# Altium schematic sheet Power Interface.SchDoc
size A; SheetNumber: 1; SheetTotal: 5
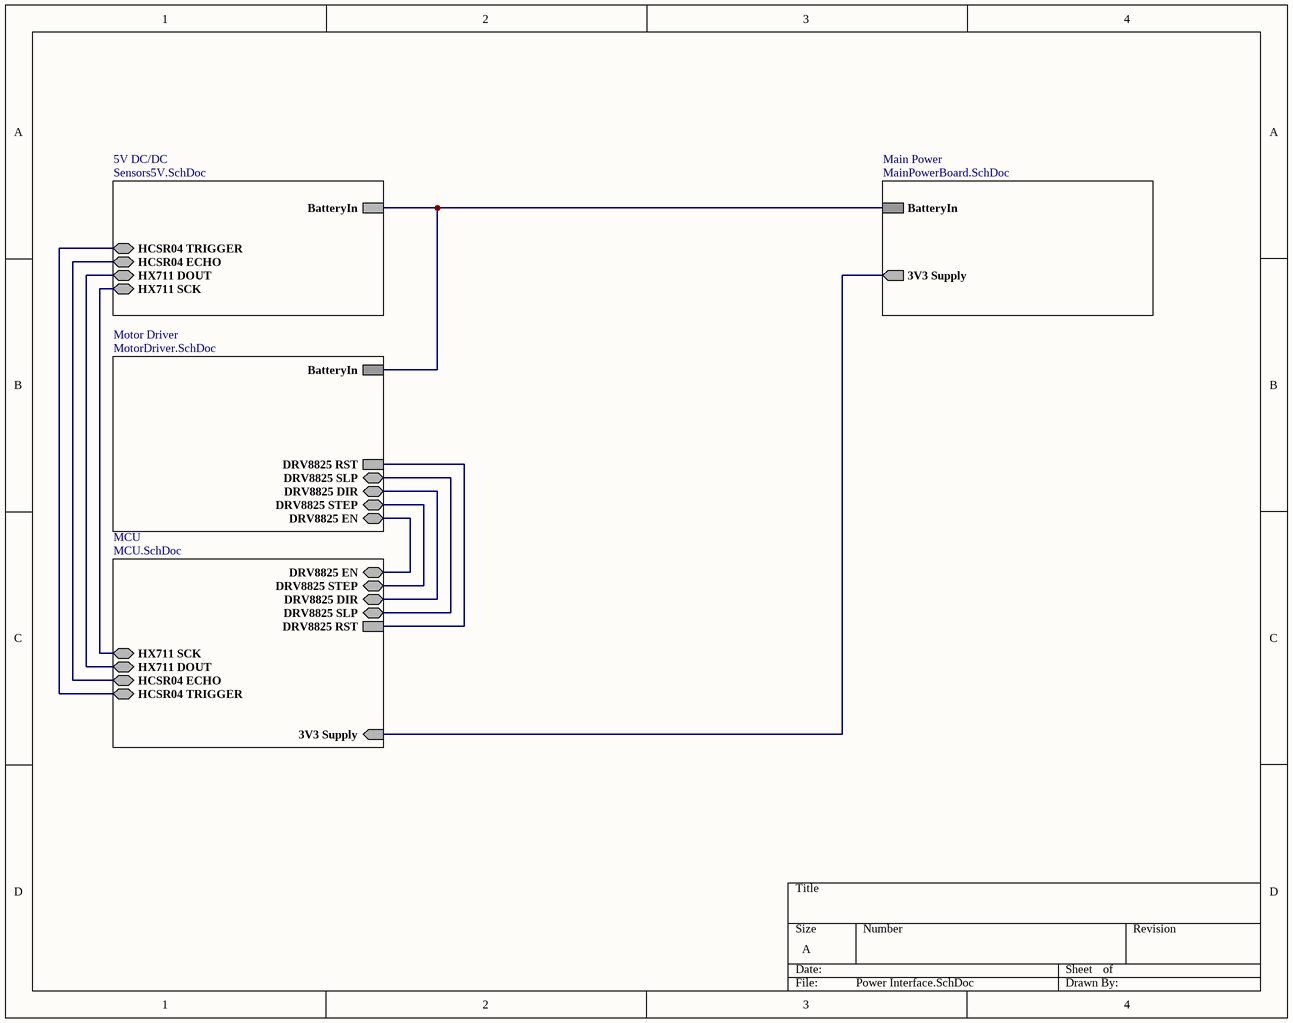
[diagram p0: Power Interface.SchDoc]

## Sub-sheets
5V DC/DC = Sensors5V.SchDoc: BatteryIn, HX711 DOUT (bidir), HX711 SCK (bidir), HCSR04 ECHO (bidir), HCSR04 TRIGGER (bidir)
Main Power = MainPowerBoard.SchDoc: BatteryIn, 3V3 Supply (out)
MCU = MCU.SchDoc: 3V3 Supply (in), DRV8825 EN (bidir), DRV8825 STEP (bidir), DRV8825 SLP (bidir), DRV8825 DIR (bidir), DRV8825 RST, HX711 SCK (bidir), HX711 DOUT (bidir), HCSR04 ECHO (bidir), HCSR04 TRIGGER (bidir)
Motor Driver = MotorDriver.SchDoc: BatteryIn, DRV8825 EN (bidir), DRV8825 STEP (bidir), DRV8825 DIR (bidir), DRV8825 SLP (bidir), DRV8825 RST

## Nets
(unnamed): sheet 5V DC/DC/BatteryIn, sheet Main Power/BatteryIn, sheet Motor Driver/BatteryIn
(unnamed): sheet 5V DC/DC/HX711 DOUT, sheet MCU/HX711 DOUT
(unnamed): sheet 5V DC/DC/HX711 SCK, sheet MCU/HX711 SCK
(unnamed): sheet 5V DC/DC/HCSR04 ECHO, sheet MCU/HCSR04 ECHO
(unnamed): sheet 5V DC/DC/HCSR04 TRIGGER, sheet MCU/HCSR04 TRIGGER
(unnamed): sheet Main Power/3V3 Supply, sheet MCU/3V3 Supply
(unnamed): sheet Motor Driver/DRV8825 EN, sheet MCU/DRV8825 EN
(unnamed): sheet Motor Driver/DRV8825 STEP, sheet MCU/DRV8825 STEP
(unnamed): sheet Motor Driver/DRV8825 DIR, sheet MCU/DRV8825 DIR
(unnamed): sheet Motor Driver/DRV8825 SLP, sheet MCU/DRV8825 SLP
(unnamed): sheet Motor Driver/DRV8825 RST, sheet MCU/DRV8825 RST